# Altium schematic sheet Blokowy.SchDoc
size A4; Organization: Altium Limited; Address1: L3, 12a Rodborough Rd; Address2: Frenchs Forest; Address3: NSW; Address4: Australia 2086
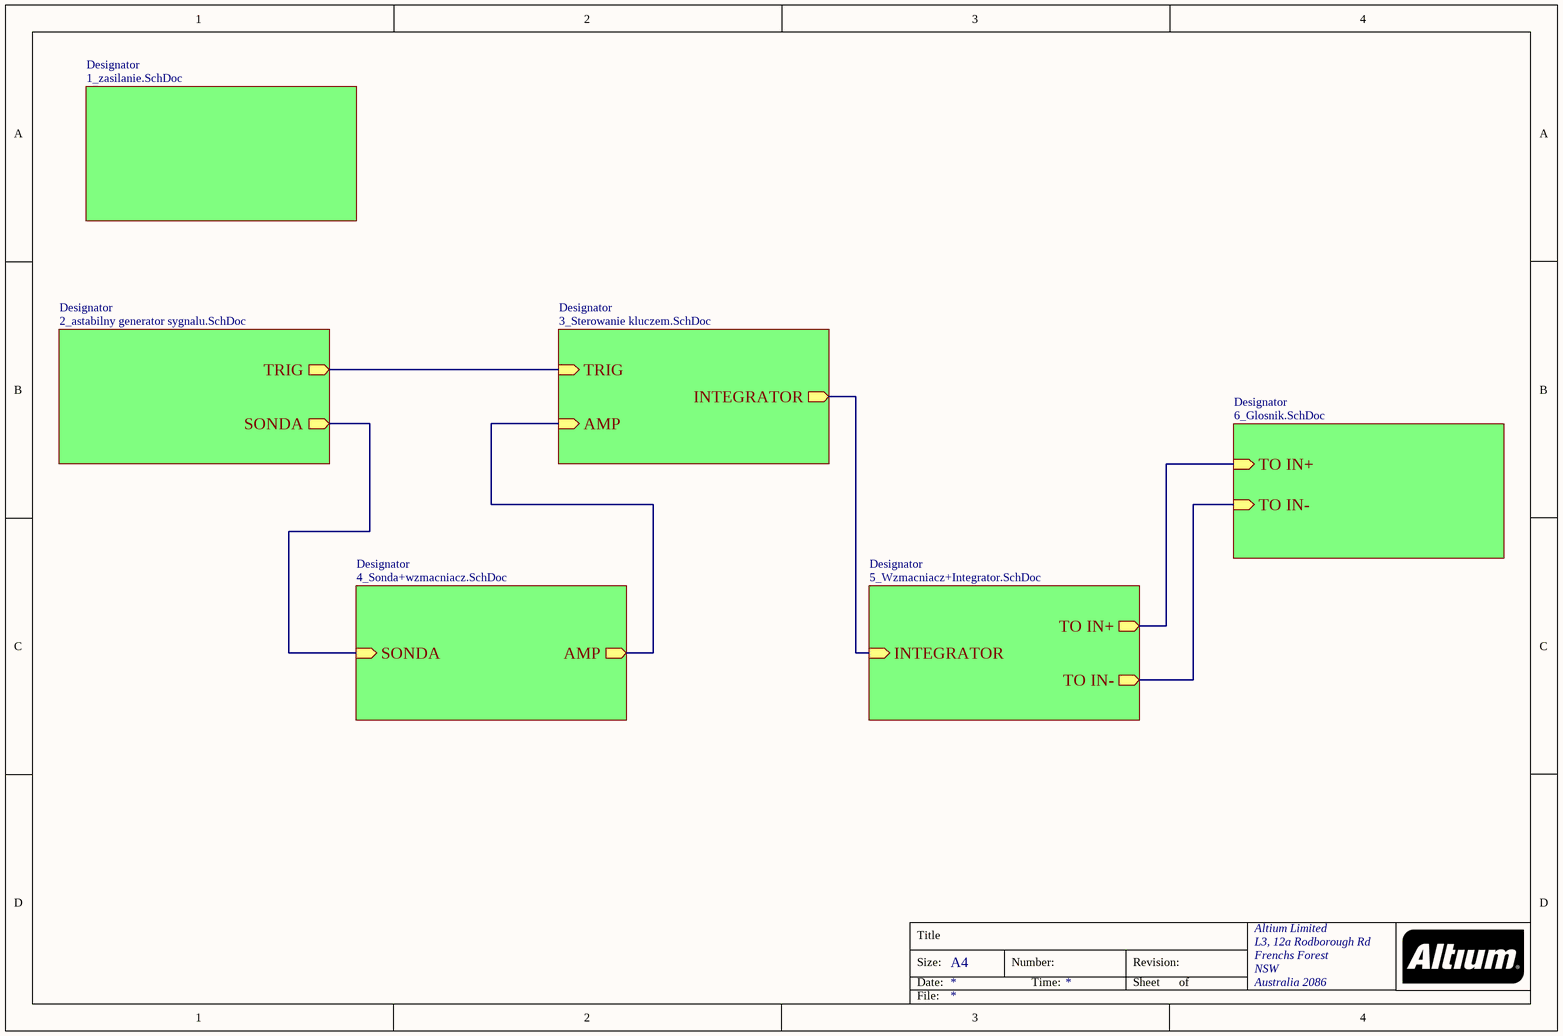
[diagram p0: Blokowy.SchDoc]

## Sub-sheets
Designator = 1_zasilanie.SchDoc: no entries
Designator = 2_astabilny generator sygnalu.SchDoc: TRIG (out), SONDA (out)
Designator = 3_Sterowanie kluczem.SchDoc: TRIG (in), AMP (in), INTEGRATOR (out)
Designator = 4_Sonda+wzmacniacz.SchDoc: SONDA (in), AMP (out)
Designator = 5_Wzmacniacz+Integrator.SchDoc: INTEGRATOR (in), TO IN+ (out), TO IN- (out)
Designator = 6_Glosnik.SchDoc: TO IN+ (in), TO IN- (in)

## Nets
(unnamed): sheet Designator/TRIG, sheet Designator/TRIG
(unnamed): sheet Designator/SONDA, sheet Designator/SONDA
(unnamed): sheet Designator/AMP, sheet Designator/AMP
(unnamed): sheet Designator/INTEGRATOR, sheet Designator/INTEGRATOR
(unnamed): sheet Designator/TO IN+, sheet Designator/TO IN+
(unnamed): sheet Designator/TO IN-, sheet Designator/TO IN-

## Notes on the sheet
- Title
- Size:
- Date:
- A4
- Number:
- Time:
- Revision:
- Sheet
- of
- File: